# EAGLE design mice poke simple v1.3 (EAGLE 6.5.0)
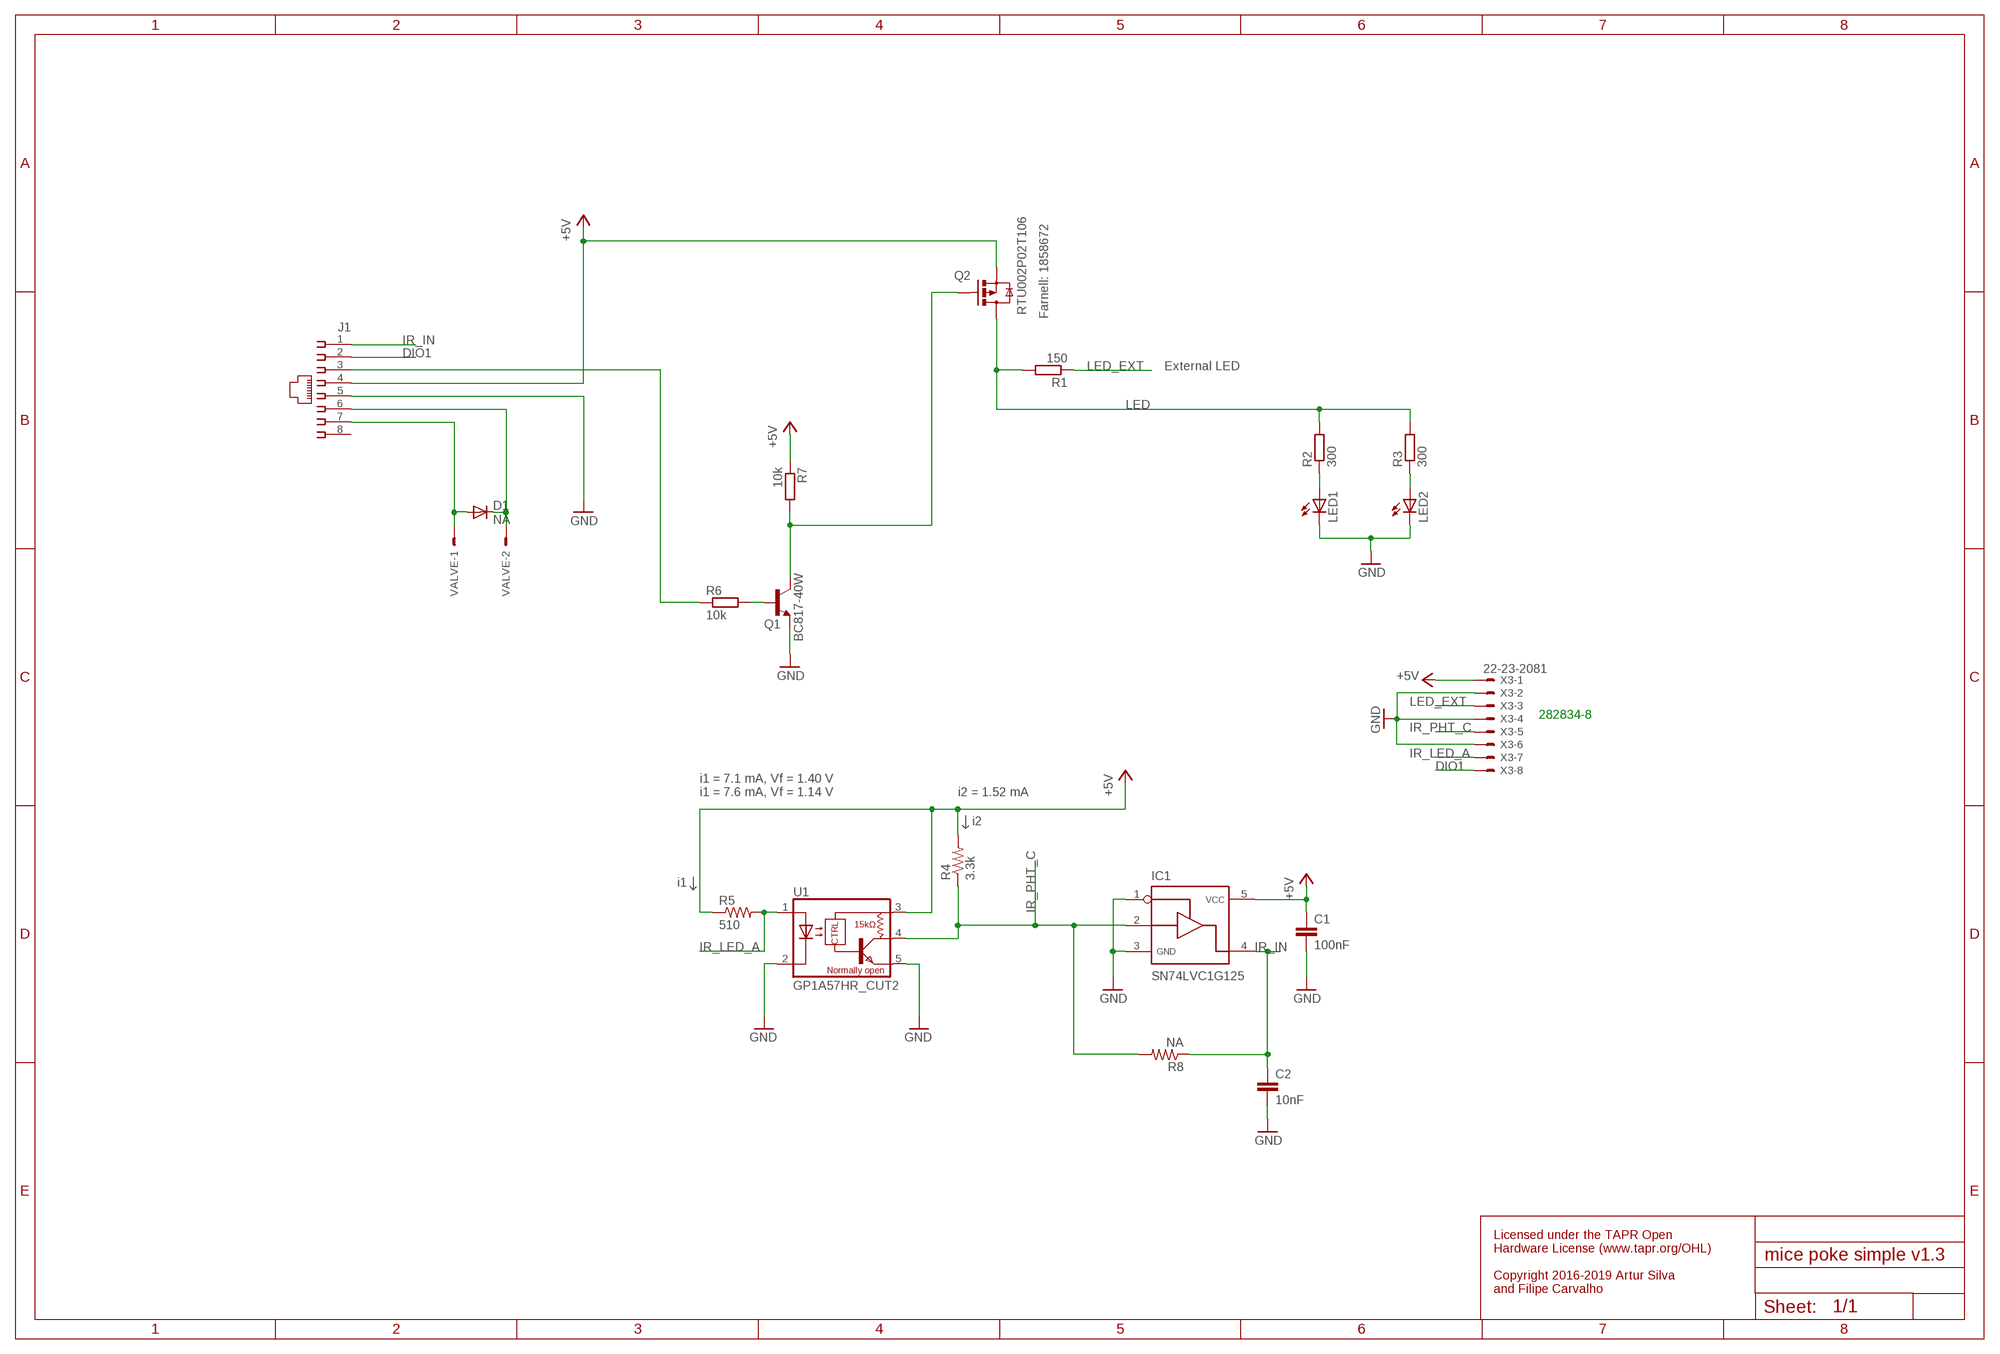
[diagram p0: schematic, sheet 1]

## Parts
C1  100nF  C-EUC0402  [C0402]
C2  10nF  C-EUC0402  [C0402]
D1  NA  DIODE-SOD323-R  [SOD323-R]
IC1  SN74LVC1G125  [SOT23-5]
J1  215878-2  [215878-2]
LED1  LED3MM  [LED3MM]
LED2  LED3MM  [LED3MM]
Q1  BC817-40W  BC817  [SOT323-BEC]
Q2  RTU002P02T106  MOSFET-PCHANNEL-ROHM  [SOT323]
R1  150  R-EU_R0402  [R0402]
R2  300  R-EU_R0402  [R0402]
R3  300  R-EU_R0402  [R0402]
R4  3.3k  R-US_R0402  [R0402]
R5  510  R-US_R0402  [R0402]
R6  10k  R-EU_R0402  [R0402]
R7  10k  R-EU_R0402  [R0402]
R8  NA  R-US_R0402  [R0402]
U1  GP1A57HR_CUT2  [GP1A57HR_CUT2]
VALVE  22-23-2021  [22-23-2021]
X3  22-23-2081  [22-23-2081]

## Nets
+5V: C1.1 IC1.5 J1.4 Q2.1(S) R4.2 R5.1 R7.1 U1.3(VCC) X3.1
DIO1: J1.2 X3.8
GND: C1.2 C2.2 IC1.1 IC1.3 J1.5 LED1.K(C) LED2.K(C) Q1.E U1.2(C) U1.5(GND) X3.2 X3.4 X3.6
IR_IN: C2.1 IC1.4 J1.1 R8.1
IR_LED_A: R5.2 U1.1(A) X3.7
IR_PHT_C: IC1.2 R4.1 R8.2 U1.4(VO) X3.5
LED: Q2.3(D) R1.2 R2.2 R3.2
LED_EXT: R1.1 X3.3
N$5: D1.A J1.7 VALVE.1
N$6: D1.C J1.6 VALVE.2
N$8: J1.3 R6.1
N$13: LED2.A R3.1
N$14: LED1.A R2.1
N$18: Q1.C Q2.2(G) R7.2
N$19: Q1.B R6.2
Unconnected: J1.8

## Notes on the sheet
- Farnell: 1858672
- External LED
- 282834-8
- i1 = 7.1 mA, Vf = 1.40 V
  i1 = 7.6 mA, Vf = 1.14 V
- i2 = 1.52 mA
- i2
- i1
- Licensed under the TAPR Open 
  Hardware License (www.tapr.org/OHL)
  
  Copyright 2016-2019 Artur Silva
  and Filipe Carvalho

## Library data of the parts
C1 C2 = rcl:C-EU: CAPACITOR, European symbol
D1 = diode:DIODE-: DIODE
IC1 = My_library 0v2:SN74LVC1G125
J1 = con-amp:215878-2: AMP connector
LED1 LED2 = adafruit:LED: LED OSRAM: - CHIPLED LG R971, LG N971, LY N971, LG Q971, LY Q971, LO R971, LY R971 LH N974, LH R974 LS Q976, LO Q976, LY Q976 LO Q996 - Hyper CHIPLED LW Q18S LB Q993, LB Q99A, LB R99A - SideLED LS A670, LO A670, LY A670, LG A670, LP A670 LB A673, LV A673, LT A673, LW A673 LH A674 LY A675 LS A676, LA A676, LO A676, LY A676, LW A676 LS A679, LY A679, LG A679 - Hyper Micro SIDELED® LS Y876, LA Y876, LO Y876, LY Y876 LT Y87S - SmartLED LW L88C, LW L88S LB L89C, LB L89S, LG L890 LS L89K, LO L89K, LY L89K LS L896, LA L896, LO L896, LY L896 - TOPLED LS T670, LO T670, LY T670, LG T670, LP T670 LSG T670, LSP T670, LSY T670, LOP T670, LYG T670 LG T671, LOG T671, LSG T671 LB T673, LV T673, LT T673, LW T673 LH T674 LS T676, LA T676, LO T676, LY T676, LB T676, LH T676, LSB T676, LW T676 LB T67C, LV T67C, LT T67C, LS T67K, LO T67K, LY T67K, LW E67C LS E67B, LA E67B, LO E67B, LY E67B, LB E67C, LV E67C, LT E67C LW T67C LS T679, LY T679, LG T679 LS T770, LO T770, LY T770, LG T770, LP T770 LB T773, LV T773, LT T773, LW T773 LH T774 LS E675, LA E675, LY E675, LS T675 LS T776, LA T776, LO T776, LY T776, LB T776 LHGB T686 LT T68C, LB T68C - Hyper Mini TOPLED® LB M676 - Mini TOPLED Santana® LG M470 LS M47K, LO M47K, LY M47K Source: http://www.osram.convergy.de/
Q1 = transistor-npn:BC817*: NPN Transistor
Q2 = MOSFET:MOSFET-PCHANNEL-ROHM: PMOS (RTU002P02) Low On-Resistance. Low Gate Threshold Voltage. Low Input Capacitance. Fast Switching Speed. Manufacturer: ROHM
R1-R3 R6 R7 = rcl:R-EU_: RESISTOR, European symbol
R4 R5 R8 = rcl:R-US_: RESISTOR, American symbol
U1 = CNP-miscellaneous:GP1A57HR
VALVE = con-molex:22-23-2021: .100" (2.54mm) Center Header - 2 Pin; MF: MOLEX; MPN: 22-23-2021; OC_FARNELL: 1462926; OC_NEWARK: 25C3832
X3 = con-molex:22-23-2081: .100" (2.54mm) Center Header - 8 Pin; MF: MOLEX; MPN: 22-23-2081; OC_FARNELL: 1756826; OC_NEWARK: 01C7592

## Board
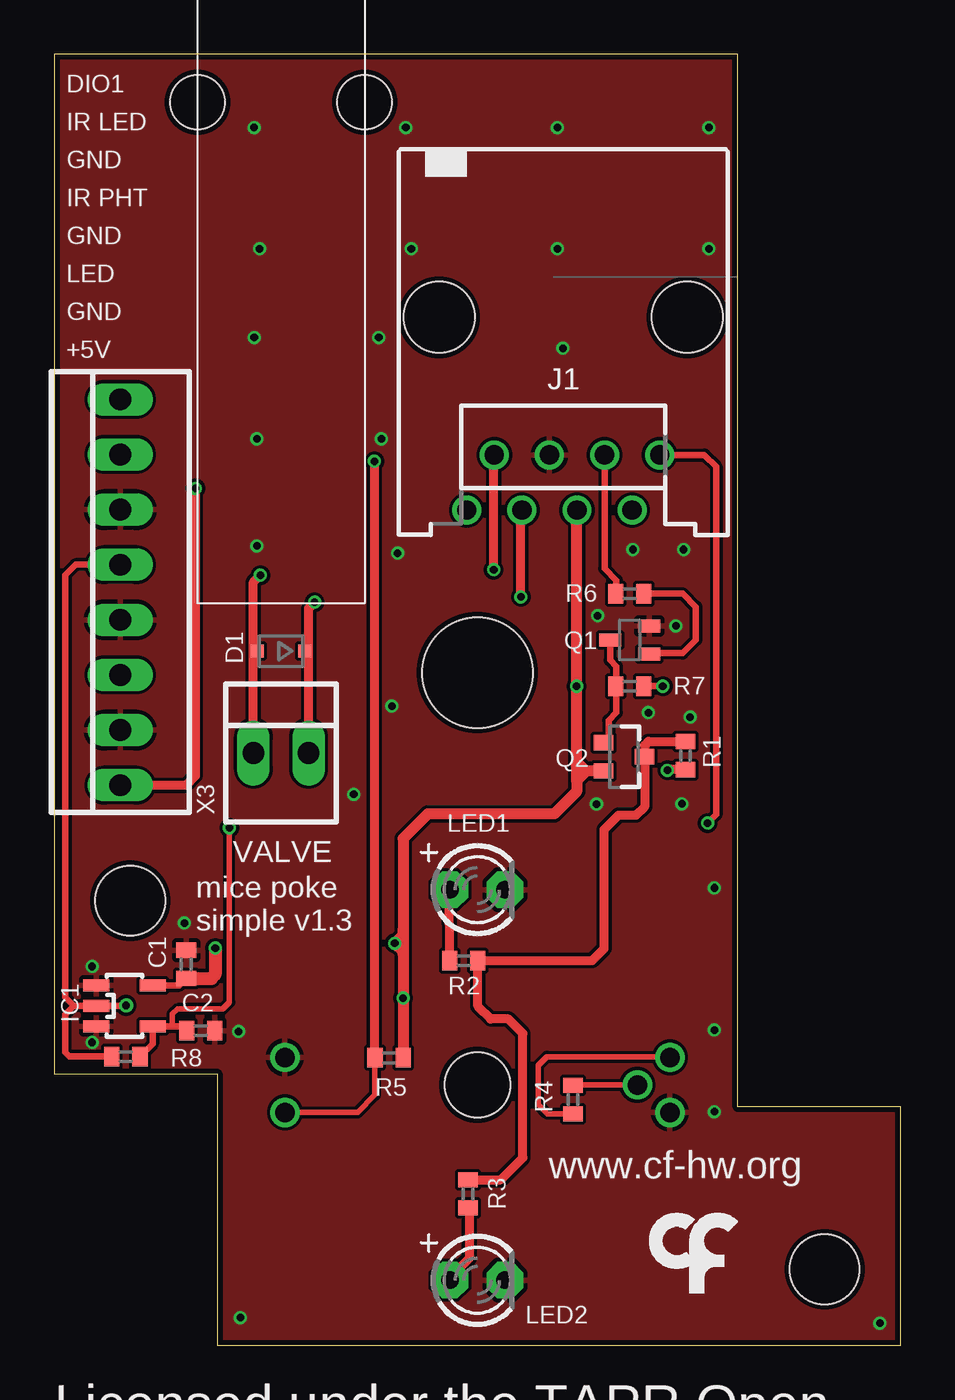
[diagram p1: board, top side]
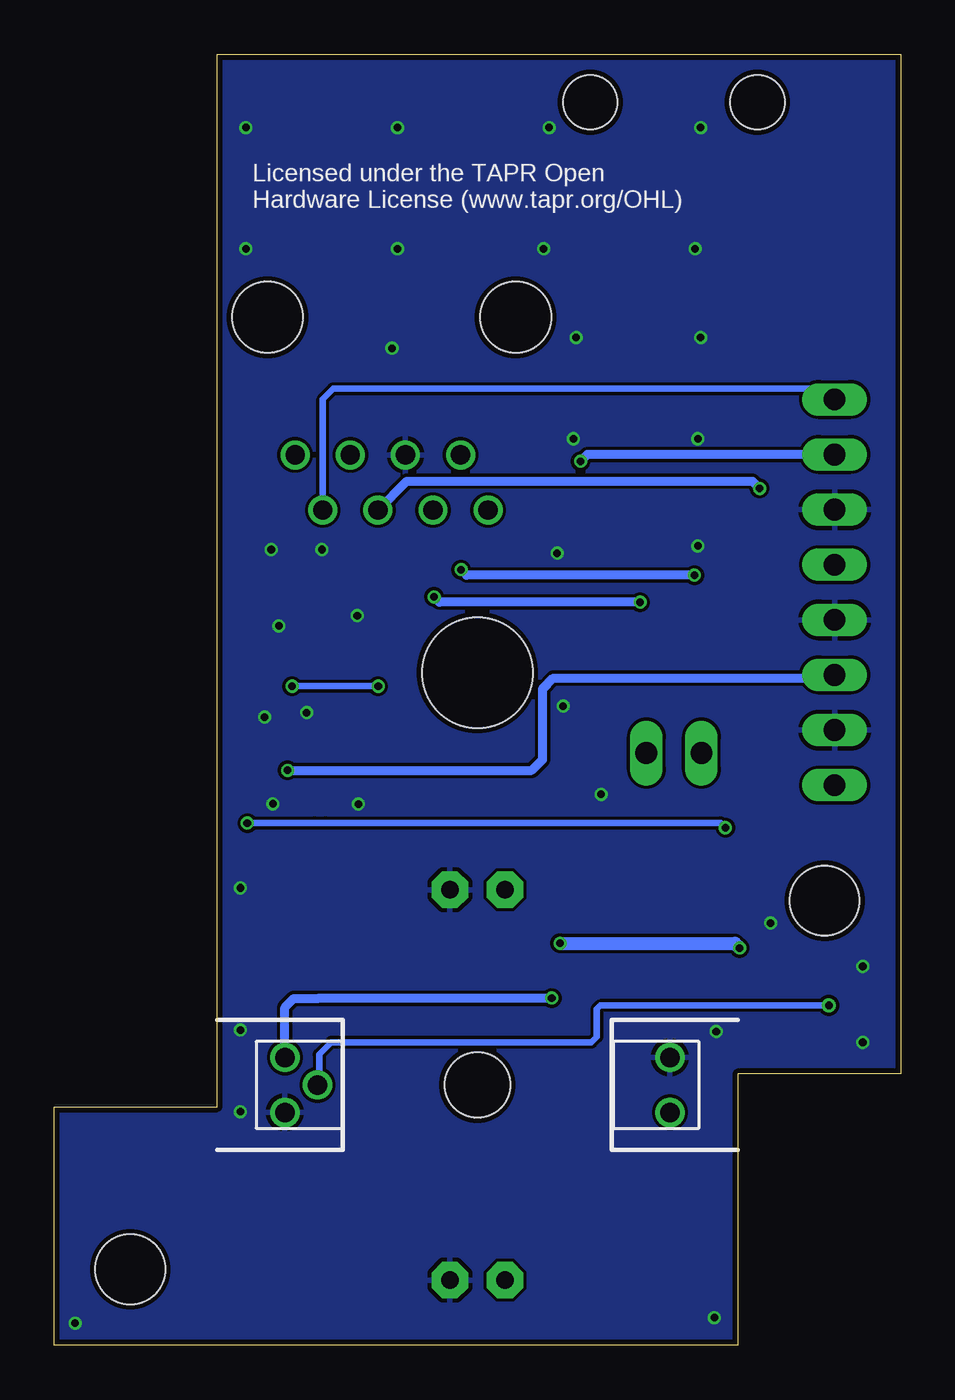
[diagram p2: board, bottom side, seen from below]

Size 39 x 59.51 mm. Coordinates in mm from the lower left corner, seen from the top.
Outline: 7.5,0 39,0 39,10.99 31.5,10.99 31.5,25.73 31.49,25.73 31.49,59.51 0,59.51 0,12.5 7.5,12.5 7.5,0
Copper layers (1*16): Top 0.018mm / dielectric 1.55mm / Bottom 0.018mm
Design rules "eC_2Layer_PClass6_BaseCopperO18_eCDefault *": minimum track width 0.15mm, minimum drill 0.35mm, track to track 0.15mm, track to pad 0.15mm, pad to pad 0.15mm, via to via 0.15mm, smd to smd 0mil, copper to edge 0.25mm, drill to drill 0.35mm, minimum pad ring 0.175mm, minimum via ring 0.125mm, stop-mask expansion 0mil, vias tented up to drill 0.45mm, thermal gap 0.2mm
Holes 3 mm at 19.5,12
Holes 3.2 mm at 35.5,3.5 3.5,20.5
Holes 5.08 mm at 19.5,31
Holes 2.5 mm at 14.3,57.3 6.6,57.3

### Footprints (pad centres in the part's own frame; a part is rotated, then mirrored left to right if it is on the bottom)
C0402 = smd 0.7 x 0.9: 1 -0.65,0; 2 0.65,0
SOD323-R = smd 0.6 x 0.6: A 1.1,0; C -1.1,0
SOT23-5 = smd 0.55 x 1.2: 1 -0.95,-1.3; 2 0,-1.3; 3 0.95,-1.3; 4 0.95,1.3; 5 -0.95,1.3
215878-2 = drill 0.889: 1 -4.445,6.35; 2 -3.175,8.89; 3 -1.905,6.35; 4 -0.635,8.89; 5 0.635,6.35; 6 1.905,8.89; 7 3.175,6.35; 8 4.445,8.89 | hole 3.251: -5.715,0; 5.715,0
LED3MM = drill 0.813 pad 1.676 octagon: A -1.27,0; K 1.27,0
SOT323-BEC = smd 0.6 x 1: B -0.65,-0.9; C 0,0.9; E 0.65,-0.9
SOT323 = smd 0.7 x 0.9: 1 0.65,-0.95; 2 -0.65,-0.95; 3 0,0.95
R0402 = smd 0.7 x 0.9: 1 -0.65,0; 2 0.65,0
GP1A57HR_CUT2 = drill 0.9: 1 1.27,8.87; 2 -1.27,8.87; 3 -1.27,-8.87; 4 0,-7.37; 5 1.27,-8.87
22-23-2021 = drill 1 long: 1 -1.27,0; 2 1.27,0
22-23-2081 = drill 1 long: 1 -8.89,0; 2 -6.35,0; 3 -3.81,0; 4 -1.27,0; 5 1.27,0; 6 3.81,0; 7 6.35,0; 8 8.89,0

### Placement (x,y rotation side)
C1  6.08,17.56 90 top
C2  6.75,14.5 0 top
D1  10.45,31.99 180 top
IC1  3.24,15.65 270 top
J1  23.45,47.39 180 top
LED1  19.5,21 0 top
LED2  19.5,3 0 top
Q1  26.52,32.51 90 top
Q2  26.25,27.13 270 top
R1  29.09,27.18 90 top
R2  18.87,17.73 0 top
R3  19.06,6.98 90 top
R4  23.9,11.32 270 top
R5  15.43,13.25 180 top
R6  26.52,34.65 0 top
R7  26.52,30.38 180 top
R8  3.3,13.31 180 top
U1  19.5,12 270 bottom
U$2  [LOGO_7]  28.64,4.83 0 top
VALVE  10.45,27.3 0 top
X3  3.04,34.71 90 top

### Tracks (layer width: path | path; a pad name or v marks a point on that pad's centre or on a via)
+5V  (via drill 0.35, 0.35 pad 0.6)
  Top 0.254: R4.2 22.73,10.67 22.3,11.1 22.3,12.9 22.7,13.3 28.04,13.3 U1.3
  Top 0.305: 24.51,26.48 24.51,26.57 24.43,26.57 | R7.1 v28.04,30.38 | IC1.5 5.77,16.6 C1.1
  Top 0.406: 16.05,13.23 R5.1 | v6.5,39.5 6.5,26.26 6.05,25.81 X3.1
  Top 0.457: 24.08,27.48 24.08,26.92 24.43,26.57
  Top 0.508: 16.07,18.53 16.07,23.36 17.21,24.5 23.04,24.5 24.07,25.53 24.07,26.04 24.11,26.08 | 16.07,18.53 v16.07,16 R5.1 | v15.69,18.53 16.07,18.53 | v15.69,18.53 16.07,18.91 16.07,19.16 | v15.69,18.53 16.07,18.15 16.07,18.02 | Q2.1 24.51,26.48 24.11,26.08 | J1.4 24.07,38.48 v24.07,30.38 24.07,26.08 24.11,26.08
  Top 0.61: v7.42,18.31 7.42,17.09 7.24,16.91 C1.1
  Bottom 0.305: v28.04,30.38 v24.07,30.38
  Bottom 0.406: J1.4 22.75,39.83 6.83,39.83 v6.5,39.5 | U1.3 28.37,15.57 27.96,15.98 26.87,15.98 26.87,15.99 16.09,15.99 v16.07,16
  Bottom 0.61: v15.69,18.53 7.64,18.53 v7.42,18.31
DIO1
  Bottom 0.305: J1.2 26.63,43.61 26.14,44.09 3.53,44.09 X3.8
GND  (via drill 0.35)
  other vias: 13.8,25.4 8.58,1.27 38.04,1.02 30.17,50.55 15.82,36.51 16.45,50.55 30.42,21.08 30.42,14.53 30.42,10.77 8.49,14.46 24.99,24.94 28.92,24.96 29.3,28.96 30.17,56.13 23.18,56.13 16.2,56.13 23.18,50.55 9.21,56.13 9.47,50.55 9.22,46.46 14.95,46.46 23.44,45.96 15.55,29.46 9.34,41.78 9.34,36.85 15.07,41.78 25.04,33.63 26.66,36.68 29,36.68 27.37,29.16 5.99,19.46 28.65,33.16 1.74,13.96 1.74,17.46
  pour Top (rank 2): 0,59.39 31.5,59.39 31.5,11 39,11 39,0 7.5,0 7.5,12.5 0,12.5
  pour Bottom: 0,59.39 31.5,59.39 31.5,11 39,11 39,0 7.5,0 7.5,12.5 0,12.5
IR_IN  (via drill 0.35 pad 0.6)
  Top 0.254: 5.5,14.7 5.45,14.75 5.45,15.27 5.68,15.5 7.76,15.5 8.07,15.81 v8.07,23.86
  Top 0.305: C2.1 5.9,14.7 5.5,14.7 IC1.4 4.54,13.9 R8.1 | J1.1 29.96,41.04 30.5,40.5 30.5,24.47 v30.11,24.07
  Bottom 0.305: 27.02,24.08 26.5,24.08 | 26.5,24.08 8.29,24.08 v8.07,23.86 | v30.11,24.07 26.51,24.07 26.5,24.08
IR_LED_A  (via drill 0.35 pad 0.6)
  Top 0.254: U1.1 13.97,10.73 14.78,11.53 R5.2
  Top 0.406: v14.75,40.75 14.75,13.28 R5.2
  Bottom 0.406: X3.7 14.44,41.06 v14.75,40.75
IR_PHT_C  (via drill 0.35 pad 0.65)
  Top 0.254: 23.93,12 U1.4
  Top 0.305: v3.31,15.66 3.32,15.65 IC1.2 0.9,15.65 | X3.5 0.98,35.98 0.5,35.5 0.5,16.05 0.9,15.65 | R8.2 0.69,13.31 0.5,13.5 0.5,15.25 0.9,15.65
  Top 0.406: 23.93,12 R4.1
  Bottom 0.305: v3.31,15.66 13.84,15.66 14,15.5 14,14.22 14.25,13.97 26.23,13.97 26.8,13.4 26.8,12.07 U1.4
LED
  Top 0.406: R3.2 20.57,7.63 21.59,8.65 21.59,14.37 20.92,15.04 20.11,15.04 19.52,15.63 R2.2 24.78,17.73 25.34,18.29 25.34,23.77 26,24.43 26.82,24.43 27.2,24.82 Q2.3 27.2,27.66 27.38,27.83 R1.2
LED_EXT  (via drill 0.35 pad 0.6)
  Top 0.406: R1.1 28.22,26.53 v28.25,26.5
  Bottom 0.406: v28.25,26.5 17,26.5 16.5,27 16.5,30.25 16,30.75 3.19,30.75 X3.3
N$5  (via drill 0.35 pad 0.6)
  Top 0.254: D1.A 9.18,32 9.18,32.51
  Top 0.406: VALVE.1 9.18,32.51 9.18,35.18 v9.5,35.5 | v20.25,35.75 20.25,41.01 J1.7
  Bottom 0.406: v9.5,35.5 20,35.5 v20.25,35.75
N$6  (via drill 0.35 pad 0.6)
  Top 0.254: D1.C 11.72,32 11.72,32.11
  Top 0.406: VALVE.2 11.72,32.11 11.72,33.97 v12,34.25 | v21.5,34.5 21.5,38.45 J1.6
  Bottom 0.406: v12,34.25 21.25,34.25 v21.5,34.5
N$8
  Top 0.305: J1.3 25.36,35.81 25.91,35.26 25.91,34.69 R6.1
N$13
  Top 0.406: R3.1 19.12,6.35 19.12,4 18.17,3.06 LED2.A
N$14
  Top 0.406: R2.1 18.21,20.98 LED1.A
N$18
  Top 0.305: Q1.C 25.62,31.58 25.91,31.29 25.91,30.42 R7.2 25.91,30.34 25.91,29.16 25.55,28.8 25.55,28.03 Q2.2
N$19
  Top 0.305: R6.2 28.96,34.65 29.57,34.04 29.57,32.51 28.96,31.9 27.46,31.9 Q1.B

### Text on the board
tPlace: DIO1 | IR LED | GND | IR PHT | GND | LED | GND | +5V | mice poke / simple v1.3 | www.cf-hw.org | Licensed under the TAPR Open / Hardware License (www.tapr.org/OHL) / / Copyright 2016-2019 Artur Silva and Filipe Carvalho
bPlace: Licensed under the TAPR Open / Hardware License (www.tapr.org/OHL)